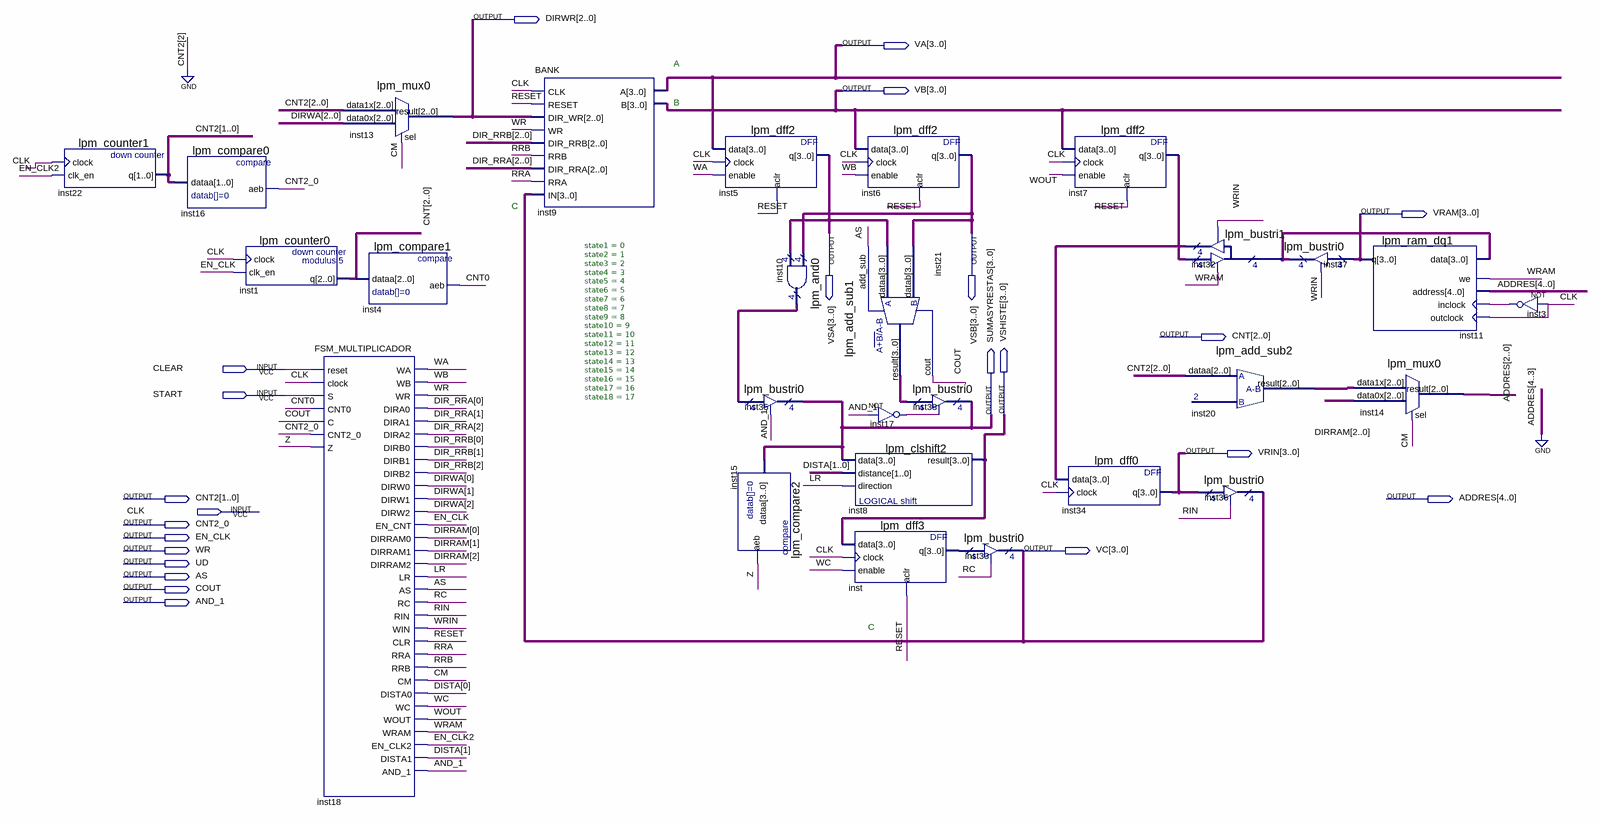
[diagram p0: schematic sheet]
// Quartus schematic MULTIPLICADOR.bdf as structural Verilog: 27 symbols, 23 pins
module MULTIPLICADOR (
  input  CLEAR,
  input  START,
  input  CLK,
  output [2:0] DIRWR,
  output [3:0] VA,
  output [3:0] VB,
  output [3:0] VRAM,
  output [3:0] VSA,
  output [3:0] VSB,
  output [2:0] CNT,
  output [3:0] SUMASYRESTAS,
  output [3:0] VSHISTE,
  output [3:0] VRIN,
  output [1:0] CNT2,
  output [4:0] ADDRES,
  output CNT2_0,
  output EN_CLK,
  output WR,
  output [3:0] VC,
  output UD,
  output AS,
  output COUT,
  output AND_1
);

  wire CM, EN_CLK2, inst3_out, inst17_out, LR, RC, RESET, RIN, RRA, RRB, WA, WB, WC, WOUT, WRAM, WRIN, Z;
  wire [1:0] DISTA;
  wire [2:0] DIR_RRA, DIR_RRB, DIRRAM, DIRWA, inst20_result;
  wire [3:0] inst7_q, inst10_result, inst21_result, inst32_result, inst32_tridata, inst_q;

  lpm_counter1 inst22 (.clock(CLK), .clk_en(EN_CLK2), .q(CNT2));
  lpm_compare0 inst16 (.dataa(CNT2), .aeb(CNT2_0));
  lpm_counter0 inst1 (.clock(CLK), .clk_en(EN_CLK), .q(CNT));
  FSM_MULTIPLICADOR #(.state1(0), .state2(1), .state3(2), .state4(3), .state5(4), .state6(5), .state7(6), .state8(7), .state9(8), .state10(9), .state11(10), .state12(11), .state13(12), .state14(13), .state15(14), .state16(15), .state17(16), .state18(17)) inst18 (
    .reset(CLEAR), .clock(CLK), .S(START), .CNT0(CNT[0]), .C(COUT), .CNT2_0(CNT2_0), .Z(Z), .WA(WA), .WB(WB),
    .WR(WR), .DIRA0(DIR_RRA[0]), .DIRA1(DIR_RRA[1]), .DIRA2(DIR_RRA[2]), .DIRB0(DIR_RRB[0]),
    .DIRB1(DIR_RRB[1]), .DIRB2(DIR_RRB[2]), .DIRW0(DIRWA[0]), .DIRW1(DIRWA[1]), .DIRW2(DIRWA[2]),
    .EN_CNT(EN_CLK), .DIRRAM0(DIRRAM[0]), .DIRRAM1(DIRRAM[1]), .DIRRAM2(DIRRAM[2]), .LR(LR), .AS(AS),
    .RC(RC), .RIN(RIN), .WIN(WRIN), .CLR(RESET), .RRA(RRA), .RRB(RRB), .CM(CM), .DISTA0(DISTA[0]), .WC(WC),
    .WOUT(WOUT), .WRAM(WRAM), .EN_CLK2(EN_CLK2), .DISTA1(DISTA[1]), .AND_1(AND_1));
  lpm_mux0 inst13 (.data1x({1'b0, CNT2}), .data0x(DIRWA), .sel(CM), .result(DIRWR));
  lpm_compare1 inst4 (.dataa(CNT), .aeb(CNT[0]));
  BANK inst9 (
    .CLK(CLK), .RESET(RESET), .DIR_WR(DIRWR), .WR(WR), .DIR_RRB(DIR_RRB), .RRB(RRB), .DIR_RRA(DIR_RRA),
    .RRA(RRA), .IN(VC), .A(VA), .B(VB));
  lpm_dff2 inst5 (.data(VA), .clock(CLK), .enable(WA), .aclr(RESET), .q(VSA));
  lpm_bustri0 inst35 (.enabledt(AND_1), .data(inst10_result), .tridata(SUMASYRESTAS));
  lpm_compare2 inst15 (.dataa(SUMASYRESTAS), .aeb(Z));
  lpm_and0 inst10 (.data0x(VSB), .data1x(VSA), .result(inst10_result));
  lpm_add_sub1 inst21 (.dataa(VSA), .datab(VSB), .add_sub(AS), .result(inst21_result), .cout(COUT));
  lpm_clshift2 inst8 (.data(SUMASYRESTAS), .distance(DISTA), .direction(LR), .result(VSHISTE));
  lpm_dff3 inst (.data(VSHISTE), .clock(CLK), .enable(WC), .aclr(RESET), .q(inst_q));
  lpm_dff2 inst6 (.data(VB), .clock(CLK), .enable(WB), .aclr(RESET), .q(VSB));
  not inst17 (inst17_out, AND_1);
  lpm_bustri0 inst38 (.enabledt(inst17_out), .data(inst21_result), .tridata(SUMASYRESTAS));
  lpm_bustri0 inst33 (.enabledt(RC), .data(inst_q), .tridata(VC));
  lpm_dff2 inst7 (.data(VB), .clock(CLK), .enable(WOUT), .aclr(RESET), .q(inst7_q));
  lpm_dff0 inst34 (.data(inst32_result), .clock(CLK), .q(VRIN));
  lpm_bustri1 inst32 (
    .enabledt(WRAM), .data(inst7_q), .enabletr(WRIN), .result(inst32_result), .tridata(inst32_tridata));
  lpm_add_sub2 inst20 (.dataa({1'b0, CNT2}), .result(inst20_result));
  lpm_bustri0 inst36 (.enabledt(RIN), .data(VRIN), .tridata(VC));
  lpm_bustri0 inst37 (.enabledt(WRIN), .data(VRAM), .tridata(inst32_tridata));
  lpm_ram_dq1 inst11 (
    .data(inst32_tridata), .we(WRAM), .address({2'b00, ADDRES[2:0]}), .inclock(inst3_out), .outclock(CLK),
    .q(VRAM));
  lpm_mux0 inst14 (.data1x(inst20_result), .data0x(DIRRAM), .sel(CM), .result(ADDRES[2:0]));
  not inst3 (inst3_out, CLK);

  assign ADDRES[4:3] = 2'b00;

  // Notes on the sheet:
  //   A
  //   B
  //   C
  //   C
endmodule
